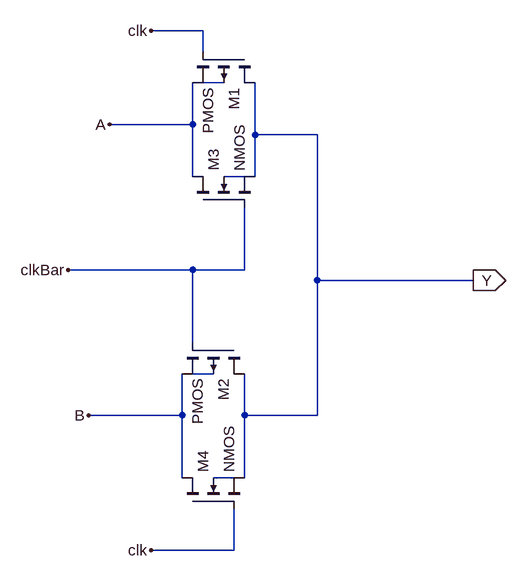
[diagram p0: schematic 2_1_mux.asc]
2_1_mux.asc, the LTspice schematic file:
Version 4.1
SHEET 1 880 680
WIRE 0 -272 -80 -272
WIRE 0 -240 0 -272
WIRE 32 -192 0 -192
WIRE -16 -128 -16 -192
WIRE -16 -128 -144 -128
WIRE 80 -112 80 -192
WIRE 176 -112 80 -112
WIRE -16 -48 -16 -128
WIRE 64 -48 32 -48
WIRE 80 -48 80 -112
WIRE -16 96 -208 96
WIRE 64 96 64 0
WIRE 64 96 -16 96
WIRE 176 112 176 -112
WIRE 416 112 176 112
WIRE -16 208 -16 96
WIRE 16 256 -16 256
WIRE -32 320 -32 256
WIRE -32 320 -176 320
WIRE 64 320 64 256
WIRE 176 320 176 112
WIRE 176 320 64 320
WIRE -32 416 -32 320
WIRE 48 416 16 416
WIRE 64 416 64 320
WIRE 48 528 48 464
WIRE 48 528 -80 528
FLAG 416 112 Y
IOPIN 416 112 Out
FLAG -80 -272 clk
FLAG -144 -128 A
FLAG -208 96 clkBar
FLAG -176 320 B
FLAG -80 528 clk
SYMBOL pmos4 80 -240 R90
SYMATTR InstName M1
SYMBOL pmos4 64 208 R90
SYMATTR InstName M2
SYMBOL nmos4 -16 0 R270
SYMATTR InstName M3
SYMBOL nmos4 -32 464 R270
SYMATTR InstName M4

The netlist it stands for:
* 2_1_mux.asc
M1 Y clk A N001 PMOS
M2 Y clkBar B N003 PMOS
M3 A clkBar Y N002 NMOS
M4 B clk Y N004 NMOS
.model NMOS NMOS
.model PMOS PMOS
.lib standard.mos
.backanno
.end